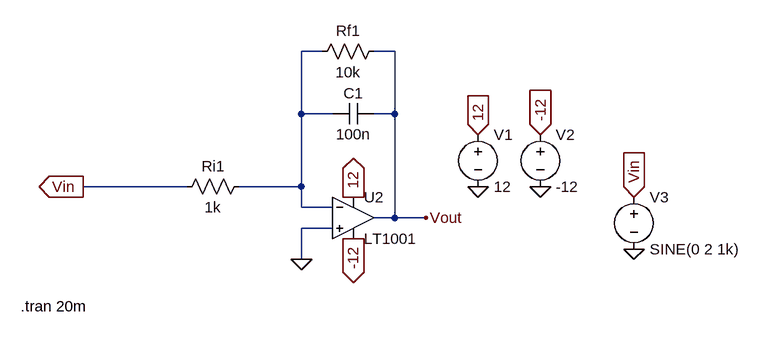
[diagram p0: schematic lab8.2.3.asc]
lab8.2.3.asc, the LTspice schematic file:
Version 4
SHEET 1 1188 680
WIRE 336 -160 304 -160
WIRE 448 -160 416 -160
WIRE 304 -64 304 -160
WIRE 352 -64 304 -64
WIRE 448 -64 448 -160
WIRE 448 -64 416 -64
WIRE 128 48 -32 48
WIRE 304 48 304 -64
WIRE 304 48 208 48
WIRE 304 80 304 48
WIRE 352 80 304 80
WIRE 448 96 448 -64
WIRE 448 96 416 96
WIRE 496 96 448 96
WIRE 352 112 304 112
WIRE 304 160 304 112
FLAG 576 48 0
FLAG 672 48 0
FLAG 576 -32 12
IOPIN 576 -32 In
FLAG 384 64 12
IOPIN 384 64 Out
FLAG 672 -32 -12
IOPIN 672 -32 In
FLAG 384 128 -12
IOPIN 384 128 Out
FLAG 816 64 Vin
IOPIN 816 64 In
FLAG -32 48 Vin
IOPIN -32 48 Out
FLAG 496 96 Vout
FLAG 304 160 0
FLAG 816 144 0
SYMBOL voltage 576 -48 R0
SYMATTR InstName V1
SYMATTR Value 12
SYMBOL voltage 672 -48 R0
SYMATTR InstName V2
SYMATTR Value -12
SYMBOL res 224 32 R90
WINDOW 0 0 56 VBottom 2
WINDOW 3 32 56 VTop 2
SYMATTR InstName Ri1
SYMATTR Value 1k
SYMBOL cap 416 -80 R90
WINDOW 0 0 32 VBottom 2
WINDOW 3 32 32 VTop 2
SYMATTR InstName C1
SYMATTR Value 100n
SYMBOL voltage 816 48 R0
WINDOW 123 0 0 Left 0
WINDOW 39 0 0 Left 0
SYMATTR InstName V3
SYMATTR Value SINE(0 2 1k)
SYMBOL Opamps\\LT1001 384 32 R0
SYMATTR InstName U2
SYMBOL res 432 -176 R90
WINDOW 0 0 56 VBottom 2
WINDOW 3 32 56 VTop 2
SYMATTR InstName Rf1
SYMATTR Value 10k
TEXT -128 232 Left 2 !.tran 20m

The netlist it stands for:
* lab8.2.3.asc
V1 12 0 12
V2 -12 0 -12
Ri1 N001 Vin 1k
C1 Vout N001 100n
V3 Vin 0 SINE(0 2 1k)
XU2 0 N001 12 -12 Vout LT1001  ; pins In+ In- V+ V- OUT
Rf1 Vout N001 10k
.tran 20m
.lib LTC.lib
.backanno
.end